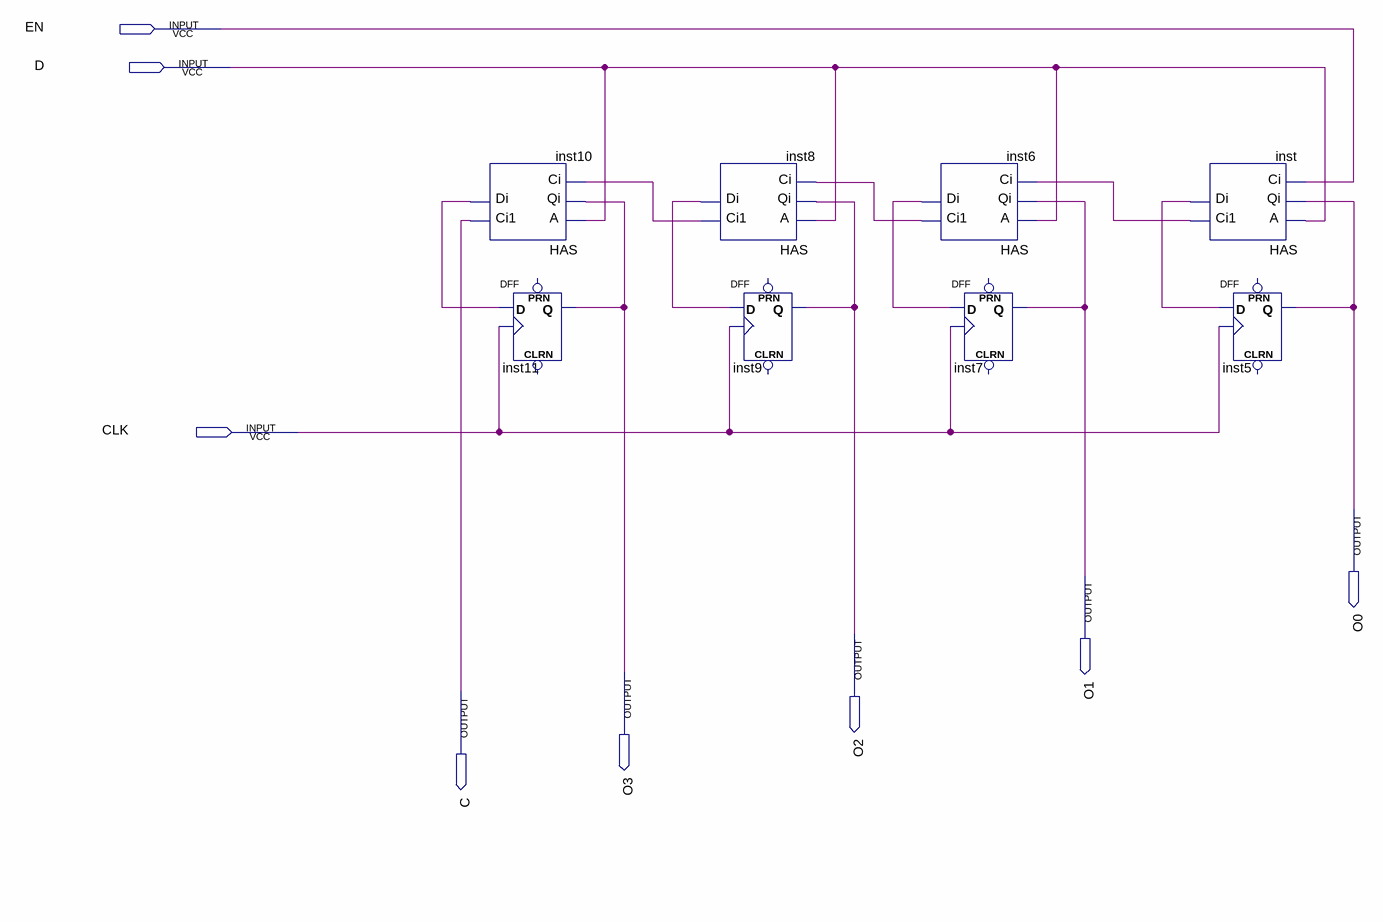
[diagram p0: schematic sheet]
// Quartus schematic UPDOWNCOUNTER4BIT.bdf as structural Verilog: 8 symbols, 8 pins
module UPDOWNCOUNTER4BIT (
  input  EN,
  input  D,
  input  CLK,
  output O0,
  output O1,
  output O2,
  output O3,
  output C
);

  wire inst6_ci1, inst6_di, inst8_ci1, inst8_di, inst10_di, inst_ci1, inst_di;

  HAS inst10 (.A(D), .Qi(O3), .Ci(inst8_ci1), .Ci1(C), .Di(inst10_di));
  DFF inst11 (.CLK(CLK), .D(inst10_di), .Q(O3));  // open: CLRN, PRN
  HAS inst8 (.A(D), .Qi(O2), .Ci(inst6_ci1), .Ci1(inst8_ci1), .Di(inst8_di));
  DFF inst9 (.CLK(CLK), .D(inst8_di), .Q(O2));  // open: CLRN, PRN
  HAS inst6 (.A(D), .Qi(O1), .Ci(inst_ci1), .Ci1(inst6_ci1), .Di(inst6_di));
  DFF inst7 (.CLK(CLK), .D(inst6_di), .Q(O1));  // open: CLRN, PRN
  HAS inst (.A(D), .Qi(O0), .Ci(EN), .Ci1(inst_ci1), .Di(inst_di));
  DFF inst5 (.CLK(CLK), .D(inst_di), .Q(O0));  // open: CLRN, PRN
endmodule
